# EAGLE design M_I_ext_sound (EAGLE 9.6.2)
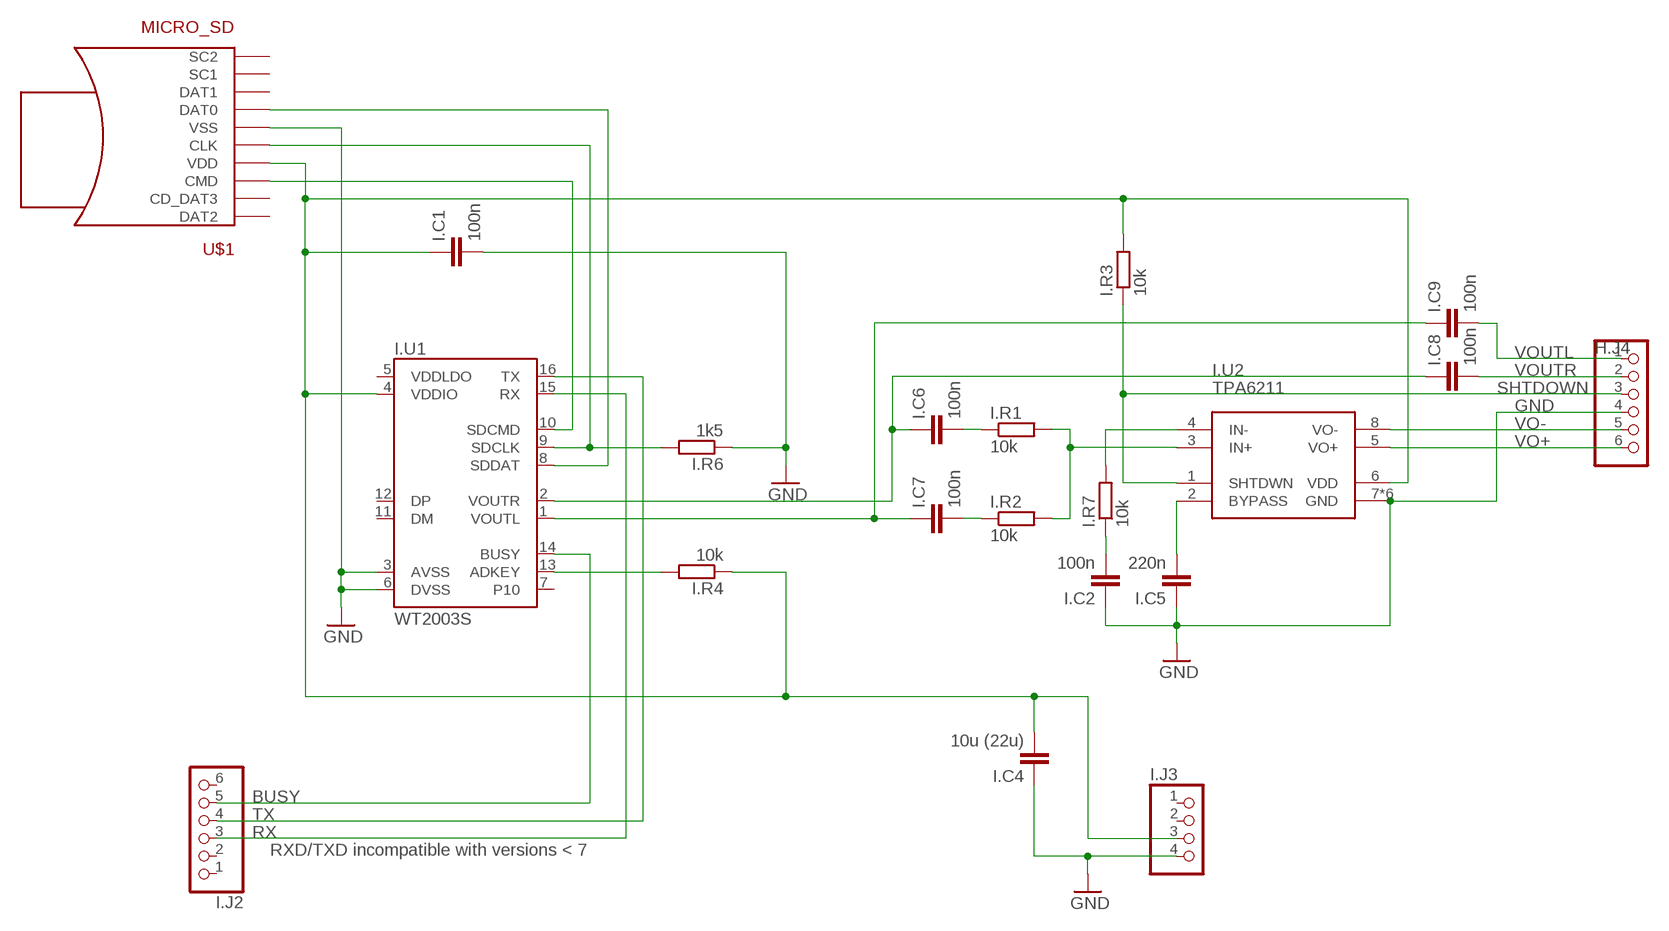
[diagram p0: schematic, sheet 1]

## Parts
H.J4  PINHD-1X6  [1X06]
I.C1  100n  C-EUC0603  [C0603]
I.C2  100n  C-EUC0603  [C0603]
I.C4  10u (22u)  C-EUC0805  [C0805]
I.C5  220n  C-EUC0603  [C0603]
I.C6  100n  C-EUC0603  [C0603]
I.C7  100n  C-EUC0603  [C0603]
I.C8  100n  C-EUC0603  [C0603]
I.C9  100n  C-EUC0603  [C0603]
I.J2  PINHD-1X6  [1X06]
I.J3  PINHD-1X4  [1X04]
I.R1  10k  R-EU_R0603  [R0603]
I.R2  10k  R-EU_R0603  [R0603]
I.R3  10k  R-EU_R0603  [R0603]
I.R4  10k  R-EU_R0603  [R0603]
I.R6  1k5  R-EU_R0603  [R0603]
I.R7  10k  R-EU_R0603  [R0603]
I.U1  WT2003S  [SO16]
I.U2  TPA6211  [MSOP-POWERPAD-8]
U$1  MICRO_SD  [MOCRO_SD]

## Nets
BUSY: I.J2.5 I.U1.14(BUSY)
GND: H.J4.4 I.C1.2 I.C2.1 I.C4.1 I.C5.1 I.J3.4 I.R6.1 I.U1.3(AVSS) I.U1.6(DVSS) I.U2.7(GND) I.U2.9(GND) I.U2.P$10(GND) I.U2.P$11(GND) I.U2.P$12(GND) I.U2.P$13(GND) U$1.6(VSS) U$1.G1(VSS) U$1.G2(VSS) U$1.G3(VSS) U$1.G4(VSS)
N$1: I.R4.2 I.U1.13(ADKEY)
N$6: I.R7.2 I.U2.4(IN-)
N$8: I.C2.2 I.R7.1
N$12: I.C6.1 I.C8.1 I.U1.2(VOUTR)
N$13: I.C7.1 I.C9.1 I.U1.1(VOUTL)
N$14: I.R1.2 I.R2.2 I.U2.3(IN+)
N$15: I.C5.2 I.U2.2(BYPASS)
N$17: I.C6.2 I.R1.1
N$18: I.C7.2 I.R2.1
RX: I.J2.3 I.U1.15(RX)
SDCLK: I.R6.2 I.U1.9(SDCLK) U$1.5(CLK)
SDCMD: I.U1.10(SDCMD) U$1.3(CMD)
SDDAT: I.U1.8(SDDAT) U$1.7(DAT0)
SHTDOWN: H.J4.3 I.R3.1 I.U2.1(SHTDWN)
TX: I.J2.4 I.U1.16(TX)
VCC: I.C1.1 I.C4.2 I.J3.3 I.R3.2 I.R4.1 I.U1.4(VDDIO) I.U2.6(VDD) U$1.4(VDD)
VO+: H.J4.6 I.U2.5(VO+)
VO-: H.J4.5 I.U2.8(VO-)
VOUTL: H.J4.1 I.C9.2
VOUTR: H.J4.2 I.C8.2
Unconnected: I.J2.1 I.J2.2 I.J2.6 I.J3.1 I.J3.2 I.U1.5(VDDLDO) I.U1.7(P10) I.U1.11(DM) I.U1.12(DP) U$1.1(DAT2) U$1.2(CD_DAT3) U$1.8(DAT1) U$1.S1(SC1) U$1.S2(SC2)

## Notes on the sheet
- RXD/TXD incompatible with versions < 7

## Library data of the parts
H.J4 I.J2 = pinhead2:PINHD-1X6: PIN HEADER
I.C1 I.C2 I.C4-I.C9 = rcl:C-EU: CAPACITOR, European symbol; SPICEPREFIX: C
I.J3 = pinhead2:PINHD-1X4: PIN HEADER
I.R1-I.R4 I.R6 I.R7 = rcl:R-EU_: RESISTOR, European symbol; SPICEPREFIX: R
I.U1 = WT2003S:WT2003S
I.U2 = hugo:TPA6211
U$1 = hugo:MICRO_SD

## Board
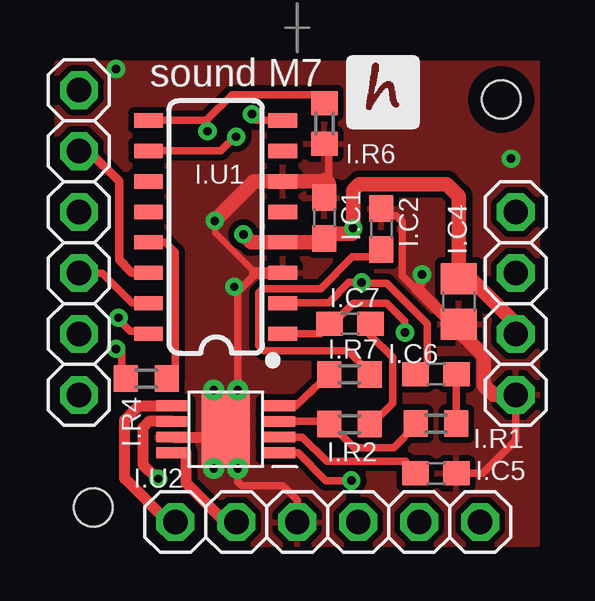
[diagram p1: board, top side]
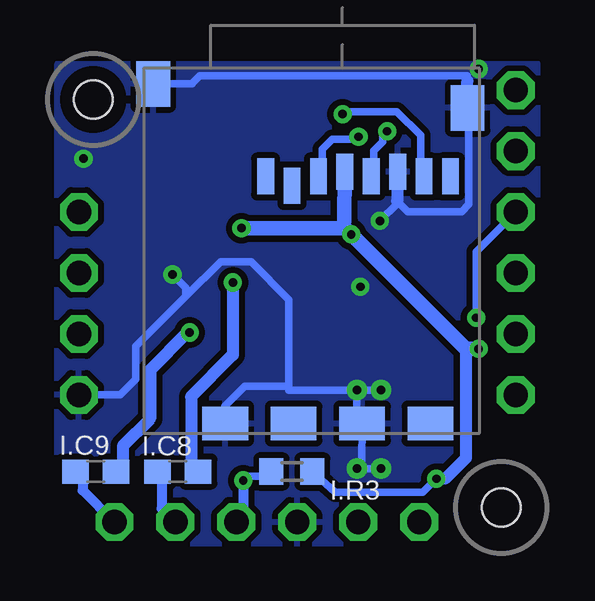
[diagram p2: board, bottom side, seen from below]

No outline drawn. Coordinates in mm, seen from the top.
Copper layers (1*16): Top 0.035mm / dielectric 1.5mm / Bottom 0.035mm
Design rules "default *": minimum track width 10mil, minimum drill 0.35mm, track to track 6mil, track to pad 6mil, pad to pad 6mil, via to via 10mil, smd to smd 6mil, copper to edge 15mil, drill to drill 15mil, minimum pad ring 10mil, minimum via ring 8mil, stop-mask expansion 4mil, vias tented up to drill 0mil, thermal gap 10mil
Holes 1.6 mm at 2,2 19,19
tRestrict: area 18,18 to 20,20; area 1,1 to 3,3
bRestrict: area 1,1 to 3,3; area 18,18 to 20,20

### Footprints (pad centres in the part's own frame; a part is rotated, then mirrored left to right if it is on the bottom)
1X06 = drill 1.016 pad 1.575 octagon: 1 -6.35,0; 2 -3.81,0; 3 -1.27,0; 4 1.27,0; 5 3.81,0; 6 6.35,0
C0603 = smd 1.1 x 1: 1 -0.85,0; 2 0.85,0
C0805 = smd 1.3 x 1.5: 1 -0.95,0; 2 0.95,0
1X04 = drill 1.016 pad 1.575 octagon: 1 -3.81,0; 2 -1.27,0; 3 1.27,0; 4 3.81,0
R0603 = smd 1 x 1.1: 1 -0.85,0; 2 0.85,0
SO16 = smd 0.6 x 1.2: 1 -4.445,-2.8; 2 -3.175,-2.8; 3 -1.905,-2.8; 4 -0.635,-2.8; 5 0.635,-2.8; 6 1.905,-2.8; 7 3.175,-2.8; 8 4.445,-2.8; 9 4.445,2.8; 10 3.175,2.8; 11 1.905,2.8; 12 0.635,2.8; 13 -0.635,2.8; 14 -1.905,2.8; 15 -3.175,2.8; 16 -4.445,2.8
MSOP-POWERPAD-8 = smd 1.4 x 0.45: 1 -2.184,0.959; 2 -2.184,0.309; 3 -2.184,-0.341; 4 -2.184,-0.991; 5 2.216,-0.991; 6 2.216,-0.341; 7 2.216,0.309; 8 2.216,0.959 | smd 2 x 3: 9 0.016,-0.016 | drill 0.35: P$10 -0.484,-1.651; P$11 0.516,-1.651; P$12 0.516,1.619; P$13 -0.484,1.619
MOCRO_SD = smd 0.7 x 1.5: 1 8.92,-10.7; 2 7.82,-10.3; 3 6.72,-10.7; 4 5.62,-10.9; 5 4.52,-10.7; 6 3.42,-10.9; 7 2.32,-10.7; 8 1.22,-10.7 | smd 1.9 x 1.4: G1 4.9,-0.4; G2 10.6,-0.4; S1 2.05,-0.4; S2 7.75,-0.4 | smd 1.4 x 1.9: G3 0.5,-13.55; G4 13.6,-14.55

### Placement (x,y rotation side)
H.J4  11.77,1.4 180 top
I.C1  11.63,14.06 90 top
I.C2  14,13.61 270 top
I.C4  17.23,10.58 90 top
I.C5  16.28,3.42 180 top
I.C6  16.28,7.56 0 top
I.C7  12.7,9.65 0 top
I.C8  15.48,3.5 180 bottom
I.C9  18.9,3.5 180 bottom
I.J2  1.4,13.04 90 top
I.J3  19.6,10.5 270 top
I.R1  16.28,5.5 180 top
I.R2  12.67,5.47 180 top
I.R3  10.73,3.5 0 bottom
I.R4  4.21,7.37 0 top
I.R6  11.63,18 90 top
I.R7  12.67,7.55 180 top
I.U1  7.1,13.69 90 top
I.U2  7.53,5.25 180 top
U$1  2.9,5.1 180 bottom

### Tracks (layer width: path | path; a pad name or v marks a point on that pad's centre or on a via)
BUSY
  Top 0.356: I.U1.14 3.61,11.78 3.07,12.32 3.07,15.6 1.82,16.85 I.J2.5
GND  (via drill 0.35)
  Top 0.254: v7.06,13.95 7.06,13.46 8.74,11.78
  Top 0.305: 7.02,4.79 I.U2.P$12 | 6.8,5.14 6.97,4.97 | I.U2.P$10 8.02,10.99 8.81,11.78 I.U1.3 | 7.19,4.94 I.U2.9 7.02,5.76 I.U2.P$11 | 10.35,1.4 H.J4.4 10.5,2.27 10.52,2.29 9.89,2.91 8.19,2.91 8.02,3.08 I.U2.P$13 | I.C5.1 18.23,3.42 19.6,4.8 I.J3.4 | I.C1.2 11.66,15.66 | I.R6.1 11.8,17.13 11.8,15.52 | I.C2.1 14.3,14.15 14.63,14.15 14.87,13.91 14.87,11.65 15.44,11.09 15.47,11.13 15.7,11.35 v15.7,11.71 | 17.41,9.19 17.33,9.12
  Top 0.457: I.U2.7 7.19,4.94
  Top 0.508: 8.74,11.78 I.U1.3 | I.U1.6 10.52,15.59 | 15.47,11.13 17.41,9.19
  Top 0.61: v7.06,13.95 8.71,15.59 I.U1.6 11.73,15.59 | 11.73,15.59 11.8,15.52 | 11.66,15.66 11.73,15.59 | I.J3.4 18.68,6.69 18.28,7.1 18.28,8.33 17.33,9.27 17.33,9.24 17.23,9.35 I.C4.1
  Bottom 0.305: I.U2.P$10 8.02,5.46 U$1.G1 7.82,3.83 I.U2.P$13 I.U2.P$12 | I.U2.P$10 10.85,6.9 10.85,7.05 | 10.85,7.05 12.69,7.05 13.52,6.22 U$1.G2 | U$1.G4 14.87,19.65 14.87,19.68 14.56,19.99 3.42,19.99 U$1.G3 3.35,18.34 3.35,14.63 3.66,14.33 5.89,14.33 6.34,14.77 6.34,14.67 v7.06,13.95 | I.U2.P$10 I.U2.P$11 | 10.85,7.05 10.85,10.67 12.42,12.24 13.69,12.24 15.14,10.79 | I.J3.4 17.87,6.69 17.22,7.34 17.22,8.71 15.14,10.79 | v15.7,11.71 15.14,11.15 15.14,10.79
  Bottom 0.508: U$1.6 6.34,14.77 | U$1.G3 3.42,19.77
  other vias: 7.87,11.2 19.41,16.54 2.95,20.27
  pour Top (isolate 0.254): 0.5,20.5 0.5,0.5 20.5,0.5 20.5,20.5
  pour Bottom (isolate 0.254): 0.5,20.5 0.5,0.5 20.5,0.5 20.5,20.5
N$1
  Top 0.254: 5.41,7.37 I.R4.2
  Top 0.305: I.U1.13 4.99,13.05 5.41,12.64 5.41,7.37
N$6
  Top 0.305: I.U2.4 10.43,6.24 I.R7.2
N$8
  Top 0.305: I.R7.1 13.25,7.76 13.25,7.88 12.59,8.53 9.09,8.53 8.89,8.74 8.89,10.95 9.07,11.12 11.47,11.12 12.8,12.45 13.69,12.45 I.C2.2
N$12  (via drill 0.35)
  Top 0.305: I.U1.2 9.92,10.54 11.81,10.54 12.65,11.38 v13.18,11.38 13.21,11.35 14.24,11.35 15.92,9.67 15.92,8.03 15.45,7.56 I.C6.1
  Bottom 0.305: 14.93,3.8 14.8,3.68 I.C8.1
  Bottom 0.508: v13.18,11.38 13.18,8.36 14.93,6.61 14.93,3.8
N$13  (via drill 0.35)
  Top 0.305: I.U1.1 11.46,9.24 I.C7.1 11.88,9.56 12.83,10.52 14.22,10.52 14.99,9.75 v14.99,9.3
  Bottom 0.305: 17.77,3.93 I.C9.1
  Bottom 0.508: 17.77,3.93 17.77,4.57 16.64,5.7 16.64,7.72 15.06,9.3 v14.99,9.3
N$14
  Top 0.305: I.U2.3 11.82,5.59 I.R2.2 11.9,5.47 12.88,4.5 14.51,4.5 15.41,5.4 I.R1.2
N$15
  Top 0.305: I.C5.2 15.02,3.92 11.73,3.92 10.71,4.94 I.U2.2
N$17
  Top 0.305: 17.11,5.62 I.R1.1 I.C6.2
N$18
  Top 0.305: I.R2.1 13.6,5.47 14.48,6.35 14.48,8.26 13.55,9.19 I.C7.2
RX
  Top 0.305: I.U1.15 4.27,10.54 3.61,10.54 2.38,11.77 I.J2.3
SDCLK  (via drill 0.35)
  Top 0.305: v6.76,17.68 6.76,18.03 6.66,18.13 | I.U1.9 6.66,18.13 | 11.73,18.79 I.R6.2 11.5,18.85 11.15,19.2 7.78,19.2 6.71,18.13 6.66,18.13
  Bottom 0.305: v6.76,17.68 6.93,17.5 6.93,17.25 7.31,16.87 7.31,15.68 U$1.5
SDCMD  (via drill 0.35)
  Top 0.305: v7.95,17.45 7.9,17.45 7.32,16.86 I.U1.10
  Bottom 0.305: U$1.3 9.46,15.73 9.46,16.92 9.03,17.35 8.05,17.35 v7.95,17.45
SDDAT  (via drill 0.35)
  Top 0.305: I.U1.8 8.79,18.13 8.61,18.31 v8.61,18.39
  Bottom 0.305: v8.61,18.39 8.51,18.49 6.35,18.49 5.37,17.51 5.37,15.68 U$1.7
SHTDOWN  (via drill 0.35)
  Top 0.305: v12.75,3.12 11.69,3.12 10.53,4.29 I.U2.1
  Bottom 0.305: I.R3.1 11.57,3.3 12.57,3.3 v12.75,3.12
  Bottom 0.406: v12.75,3.12 12.75,1.69 H.J4.3
TX  (via drill 0.35)
  Top 0.305: I.U1.16 4.2,9.34 3.55,9.34 3.05,9.84 v3.05,9.91
  Bottom 0.305: v3.05,9.91 3.05,11.15 | 3.05,11.15 3.05,12.66 I.J2.4 | 3.05,11.15
VCC  (via drill 0.35)
  Top 0.305: I.R4.1 3.18,7.55 3.18,8.49 3.06,8.61 v2.95,8.61
  Top 0.457: I.U2.6 4.32,5.59 4.06,5.33 4.06,3.79 4.66,3.2 v4.71,3.2
  Top 0.508: 11.4,13.05 11.62,13.28 I.C1.1 11.84,13.42
  Top 0.61: 11.4,13.05 I.U1.4 8.58,13.05 v8.25,13.38 | 11.84,13.42 12.78,13.42 12.83,13.46 v12.83,13.64 12.83,15.22 13.08,15.48 16.73,15.48 17.23,14.98 I.C4.2 | 19.6,9.56 I.J3.3 19.6,9.66 17.73,11.53 I.C4.2 | I.C4.2 17.45,11.75
  Bottom 0.254: 3.43,8.34 3.43,8.33 3.48,8.28
  Bottom 0.305: I.R3.2 8.93,2.64 5.27,2.64 v4.71,3.2 | 3.43,8.61 3.48,8.56
  Bottom 0.508: 3.48,8.61 3.48,8.56 3.48,8.28 3.48,4.06 4.34,3.2 v4.71,3.2 | 8.54,13.64 8.54,13.67 8.54,13.92
  Bottom 0.61: 3.48,8.61 v8.25,13.38 8.54,13.67 | 8.54,13.92 U$1.4 | v12.83,13.64 8.54,13.64 | v2.95,8.61 3.43,8.61
VO+
  Top 0.406: H.J4.6 5.12,1.4
  Top 0.457: I.U2.5 3.9,6.24 3.3,5.64 3.3,3.21 5.12,1.4
VO-
  Top 0.457: H.J4.5 7.5,1.4 5.85,3.04 5.85,4.29 I.U2.8
VOUTL
  Bottom 0.305: 19.44,3.33 I.C9.2
  Bottom 0.406: H.J4.1 19.44,2.72 19.44,3.33
VOUTR
  Bottom 0.305: I.C8.2 16.15,3.45
  Bottom 0.406: H.J4.2 16.15,1.97 16.15,3.45

### Text on the board
tPlace: sound M7